# Altium schematic sheet Motor_Outputs.SchDoc
size OrCAD A; SheetNumber: 5; SheetTotal: 5
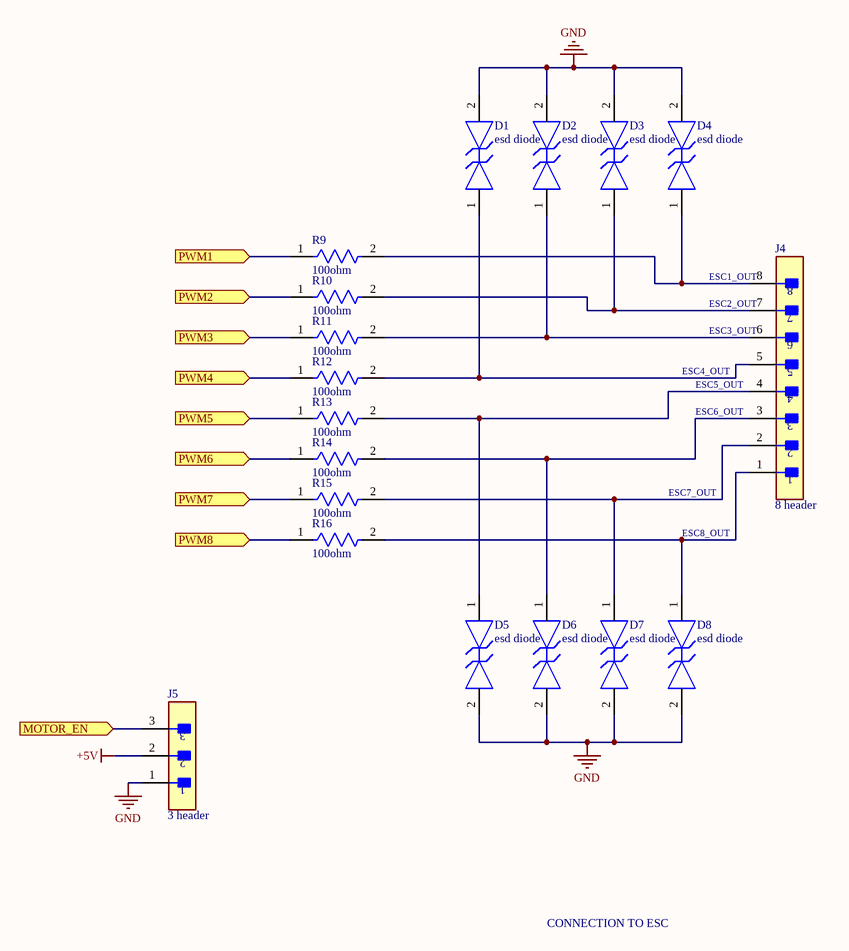
[diagram p0: Motor_Outputs.SchDoc]

## Parts
D1  esd diode  [FP-152AF-MFG]
D2  esd diode  [FP-152AF-MFG]
D3  esd diode  [FP-152AF-MFG]
D4  esd diode  [FP-152AF-MFG]
D5  esd diode  [FP-152AF-MFG]
D6  esd diode  [FP-152AF-MFG]
D7  esd diode  [FP-152AF-MFG]
D8  esd diode  [FP-152AF-MFG]
J4  8 header  [FP-B8B-XH-A_LF_SN-MFG]
J5  3 header  [FP-B3B-XH-AM_LF_SN-MFG]
R9  100ohm  [FP-RNCP0603-MFG]
R10  100ohm  [FP-RNCP0603-MFG]
R11  100ohm  [FP-RNCP0603-MFG]
R12  100ohm  [FP-RNCP0603-MFG]
R13  100ohm  [FP-RNCP0603-MFG]
R14  100ohm  [FP-RNCP0603-MFG]
R15  100ohm  [FP-RNCP0603-MFG]
R16  100ohm  [FP-RNCP0603-MFG]

## Ports
MOTOR_EN (in, see EMP_FC_Main[3C], MCU_Core[3B]), PWM1 (in, see EMP_FC_Main[2C], MCU_Core[3B]), PWM2 (in, see EMP_FC_Main[2C], MCU_Core[3B]), PWM3 (in, see EMP_FC_Main[2C], MCU_Core[3B]), PWM4 (in, see EMP_FC_Main[2C], MCU_Core[3B]), PWM5 (in, see EMP_FC_Main[2C], MCU_Core[3B]), PWM6 (in, see EMP_FC_Main[2C], MCU_Core[3B]), PWM7 (in, see EMP_FC_Main[2C], MCU_Core[3B]), PWM8 (in, see EMP_FC_Main[3C], MCU_Core[5B])

## Nets
+5V: J5.2
GND: D1.2 D2.2 D3.2 D4.2 D5.2 D6.2 D7.2 D8.2 J5.1
MOTOR_EN: J5.3 ; port MOTOR_EN
PWM1: R9.1 ; port PWM1
PWM2: R10.1 ; port PWM2
PWM3: R11.1 ; port PWM3
PWM4: R12.1 ; port PWM4
PWM5: R13.1 ; port PWM5
PWM6: R14.1 ; port PWM6
PWM7: R15.1 ; port PWM7
PWM8: R16.1 ; port PWM8
NetD1_1: D1.1 J4.5 R12.2
NetD2_1: D2.1 J4.6 R11.2
NetD3_1: D3.1 J4.7 R10.2
NetD4_1: D4.1 J4.8 R9.2
NetD5_1: D5.1 J4.4 R13.2
NetD6_1: D6.1 J4.3 R14.2
NetD7_1: D7.1 J4.2 R15.2
NetD8_1: D8.1 J4.1 R16.2

## Notes on the sheet
- (near J4) ESC1_OUT
- (near J4) ESC2_OUT
- ESC4_OUT
- (near J4) ESC5_OUT
- (near J4) ESC3_OUT
- (near J4) ESC6_OUT
- ESC7_OUT
- ESC8_OUT
- CONNECTION TO ESC

## Library data of the parts
D1-D8 = CMP-07200-000010-1: TVS DIODE 5.3V 14V 2X3DFN; Number of Bidirectional Channels: 1; Element Configuration: Single; Capacitance: 0.3pF; Peak Pulse Current: 3A; Power Line Protection: No; Min Breakdown Voltage: 7V; Direction: Bidirectional; Case/Package: DFN; Lead Free: Lead Free; Reverse Standoff Voltage: 5.3V; Clamping Voltage: 14V; Resistor Type: Zener; Packaging: Tape and Reel; Mount: Surface Mount; Number of Pins: 2; Max Operating Temperature: 150°C; Min Operating Temperature: -55°C; Working Voltage: 5.3V; RoHS Compliant: Yes
J4 = CMP-17438-000015-1: CONN HEADER VERT 8POS 2.5MM; Voltage Rating (AC): 250V; Insulation Resistance: 1GR; Connector Type: Male Pin; Max Current Rating: 3A; Wire/Cable Gauge: 22AWG; Number of Contacts: 8; Contact Resistance: 20mR; Orientation: Straight; Pitch: 2.5mm; Min Operating Temperature: -25°C; Number of Rows: 1; Contact Type: Male Pin; Packaging: Bulk; Lead Free: Lead Free; Max Operating Temperature: 85°C; Housing Material: Polyamide; Voltage Rating: 250V; Series: XH; Mount: Through Hole; Depth: 5.75mm; Contact Material: Brass; Fastening Type: Detent; Color: Natural; Max Voltage Rating (AC): 250V; Number of Positions: 8; Housing Color: White; Contact Plating: Tin; Lead Pitch: 2.5mm; Length: 22.4mm; REACH SVHC: No SVHC; Termination: Press-Fit; Current Rating: 3A
J5 = CMP-17438-000009-1: CONN HEADER VERT 3POS 2.5MM; Max Current Rating: 3A; Gender: Male; Max Voltage Rating (AC): 250V; Connector Type: Male Pin; Pitch: 0.098inch; Number of Positions: 3; Contact Resistance: 20mR; Termination: Press-Fit; Housing Color: White; Housing Material: Polyamide; Orientation: Straight; Contact Material: Brass; Contact Type: Male Pin; Color: Natural; Packaging: Bulk; Lead Free: Lead Free; Depth: 5.75mm; Number of Rows: 1; Contact Plating: Tin; Length: 9.9mm; Max Operating Temperature: 85°C; Series: XH; Min Operating Temperature: -25°C; Fastening Type: Detent; Mount: Through Hole
R9-R16 = CMP-26527-000148-1: 100Ω ±1% 0.125W 0603 High Power Anti-Sulfur Thin Film Chip Resistor; Resistance: 100R; Temperature Coefficient: 100ppm/°C; Max Power Dissipation: 125mW; Features: Moisture Resistant; Packaging: Tape and Reel; Lead Free: Lead Free; Height: 0.02inch; Series: RNCP; Contact Plating: Tin; Resistor Type: Thin Film; Case Code (Imperial): 0603; Case Code (Metric): 1608; Min Operating Temperature: -55°C; Length: 0.059inch; Number of Terminations: 2; RoHS Compliant: Yes; Tolerance: 1%; Width: 0.031inch; Max Operating Temperature: 155°C; Case/Package: 0603; Mount: Surface Mount; Radiation Hardening: No